# Altium project Percepção_Externa.PrjPcb
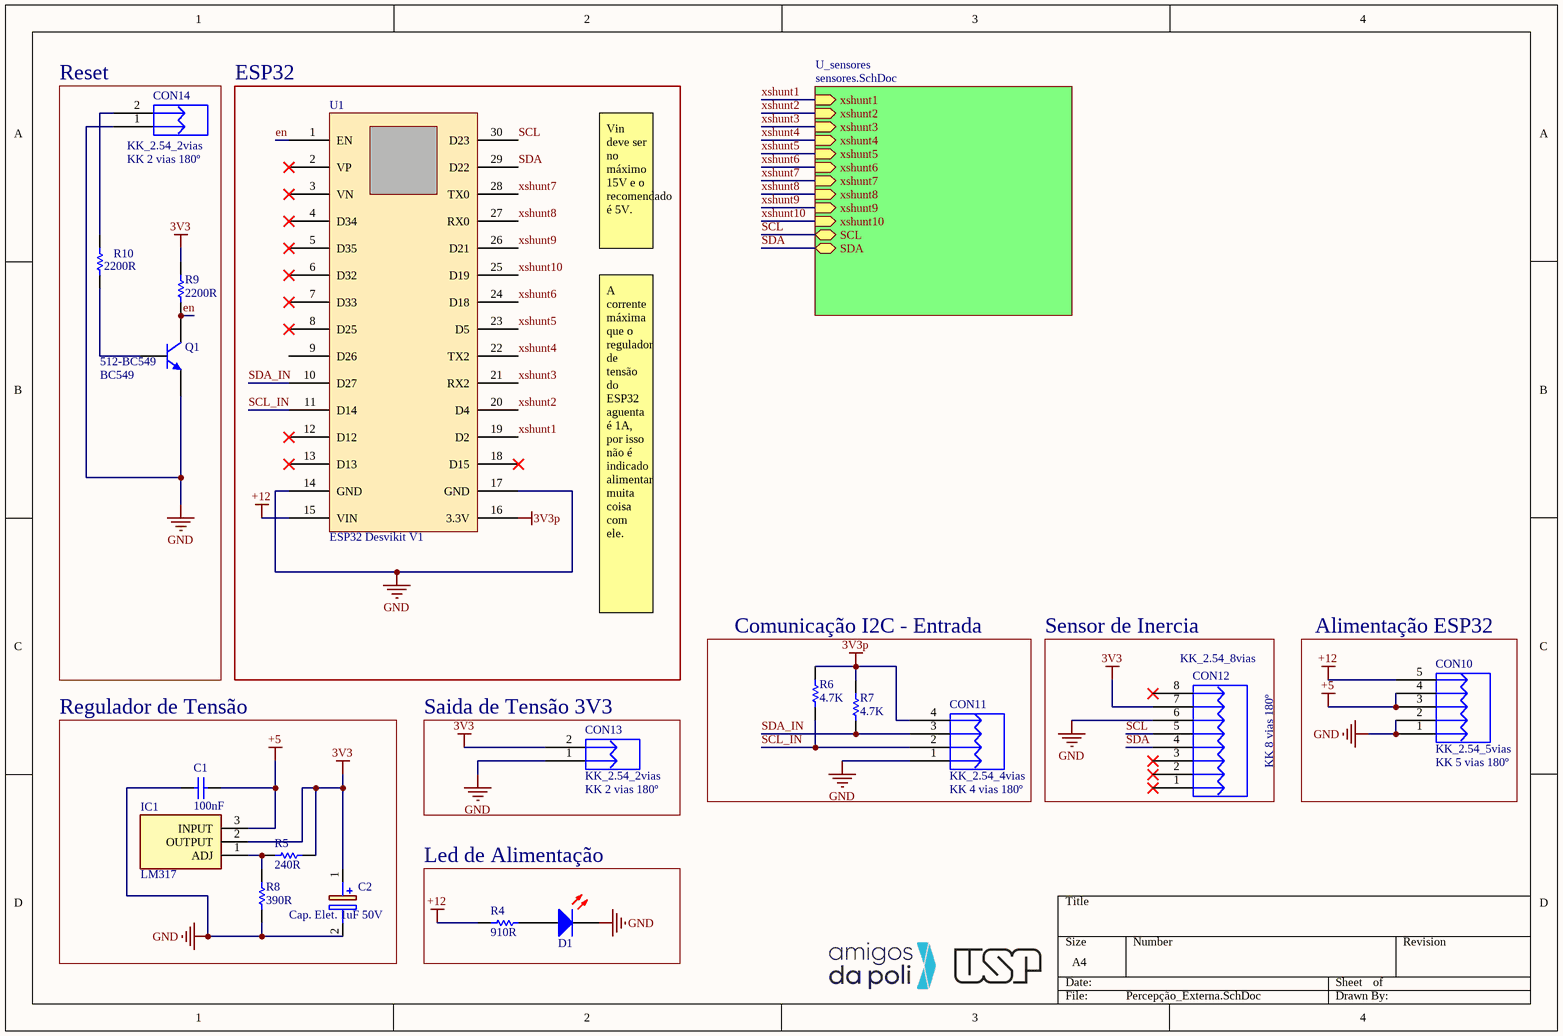
[diagram p0: Percepção_Externa.SchDoc]
1 sheet, 18 parts. Net scope: hierarchical (ports join the sheet entries above them; power ports are global).
Board file: Percepção_Externa.PcbDoc

## Sheet Percepção_Externa.SchDoc
size A4

### Parts
C1  100nF  [CAP CER DISK 100NF 50V]
C2  Cap. Elet. 1uF 50V  [Cap. Elet. 470uF 16V]
CON10  KK_2.54_5vias  Valor: KK 5 vias 180º  [KK_5vias_180°]
CON11  KK_2.54_4vias  Valor: KK 4 vias 180º  [KK_4vias_180°]
CON12  KK_2.54_8vias  Valor: KK 8 vias 180º  [KK_8vias_180°]
CON13  KK_2.54_2vias  Valor: KK 2 vias 180º  [KK_2VIAS_180º]
CON14  KK_2.54_2vias  Valor: KK 2 vias 180º  [KK_2VIAS_180º]
D1  LED 5MM RED  [LED 5MM RED]  (value not drawn)
IC1  LM317  [TO254P467X1016X1971-3P]
Q1  BC549  Supplier Part Number 1: 512-BC549  [TO92]
R4  Resistance (Ohms): 910R  [RES 470R 1/4W CARBON FILM]  (hidden comment: RES 470R 1/4W CARBON FILM)
R5  Resistance (Ohms): 240R  [RES 470R 1/4W CARBON FILM]  (hidden comment: RES 470R 1/4W CARBON FILM)
R6  4.7K  [RES 4.7K 1/4W CARBON FILM]
R7  4.7K  [RES 4.7K 1/4W CARBON FILM]
R8  Resistance (Ohms): 390R  [RES 470R 1/4W CARBON FILM]  (hidden comment: RES 470R 1/4W CARBON FILM)
R9  Resistance (Ohms): 2200R  [RES 470R 1/4W CARBON FILM]  (hidden comment: RES 470R 1/4W CARBON FILM)
R10  Resistance (Ohms): 2200R  [RES 470R 1/4W CARBON FILM]  (hidden comment: RES 470R 1/4W CARBON FILM)
U1  value ESP32 Desvikit V1  [ESP32_Desvikit_v1]  (hidden comment: microcontrolador)

### Blocks framed on the sheet
Reset: CON14 Q1 R9 R10
ESP32: U1
Comunicação I2C - Entrada: CON11 R6 R7
Sensor de Inercia: CON12
Alimentação ESP32: CON10
Regulador de Tensão: C1 C2 IC1 R5 R8
Saida de Tensão 3V3: CON13
Led de Alimentação: D1 R4

### Sub-sheets
U_sensores = sensores.SchDoc (file not in this document): xshunt1 (in), xshunt2 (in), xshunt3 (in), xshunt4 (in), xshunt5 (in), xshunt6 (in), xshunt7 (in), xshunt8 (in), xshunt9 (in), xshunt10 (in), SCL (bidir), SDA (bidir)

### Nets
3V3: C2.1(+) CON12.7 CON13.2 IC1.2(OUTPUT) R5.2 R9.2
3V3p: CON11.4 R6.1 R7.1 U1.16(3.3V)
+5: C1.2 CON10.3 CON10.4 IC1.3(INPUT)
+12: CON10.5 R4.2 U1.15(VIN)
GND: C1.1 C2.2(-) CON10.1 CON10.2 CON11.1 CON12.6 CON13.1 CON14.1 D1.2(K) Q1.3(E) R8.1 U1.14(GND) U1.17(GND)
en: Q1.1(C) R9.1 U1.1(EN)
SCL: CON12.5 U1.30(D23) ; sheet U_sensores/SCL
SCL_IN: CON11.2 R6.2 U1.11(D14)
SDA: CON12.4 U1.29(D22) ; sheet U_sensores/SDA
SDA_IN: CON11.3 R7.2 U1.10(D27)
xshunt1: U1.19(D2) ; sheet U_sensores/xshunt1
xshunt2: U1.20(D4) ; sheet U_sensores/xshunt2
xshunt3: U1.21(RX2) ; sheet U_sensores/xshunt3
xshunt4: U1.22(TX2) ; sheet U_sensores/xshunt4
xshunt5: U1.23(D5) ; sheet U_sensores/xshunt5
xshunt6: U1.24(D18) ; sheet U_sensores/xshunt6
xshunt7: U1.28(TX0) ; sheet U_sensores/xshunt7
xshunt8: U1.27(RX0) ; sheet U_sensores/xshunt8
xshunt9: U1.26(D21) ; sheet U_sensores/xshunt9
xshunt10: U1.25(D19) ; sheet U_sensores/xshunt10
NetCON14_2: CON14.2 R10.2
NetD1_1: D1.1(A) R4.1
NetIC1_1: IC1.1(ADJ) R5.1 R8.2
NetQ1_2: Q1.2(B) R10.1

Not connected (* = marked no-connect by the designer): CON12 1* 2* 3* 8*; U1 2(VP)* 3(VN)* 4(D34)* 5(D35)* 6(D32)* 7(D33)* 8(D25)* 9(D26) 12(D12)* 13(D13)* 18(D15)*

### Notes on the sheet
- Vin deve ser no máximo 15V e o recomendado é 5V.
- A corrente máxima que o regulador de tensão do  ESP32 aguenta é 1A, por isso não é indicado alimentar muita coisa com ele.

### Library data of the parts
C1 = CAP CER DISK 100NF 50V: Manufacturer Part Number: IMP14925; Product Range: MCFY Series; Capacitance: 0.1uF; Capacitance Tolerance: +80%, -20%; Dielectric Characteristic: Y5; Voltage Rating: 50; Capacitor Terminals: Radial Leaded; SVHC: No SVHC (15-Jun-2015); Supplier 1: Mult Comercial; Manufacturer: -; RoHS: YES; Stock 1: 115809; Pricing 1: 1=0.10 (BRL); Packaging: Each; Lead Spacing: 5; Operating Temperature Min: -25; Operating Temperature Max: 85; Capacitance Tolerance ±: +80%, -20%; Operating Temperature Range: -25°C to +85°C<!--FANDB--><div class="features-and-benefits-container"><div class="features-and-benefits-description"><span class="features-benefits-value">The MCFY series from Multicomp are radial leaded ceramic disc capacitors. The capacitance values ranges from 6800pF to 0.22?F.</span></div><div class="features-and-benefits-list"><ul class="features-and-benefits-list-list"><li class="features-and-benefits-list-item">Large capacitance in small size</li><li class="features-and-benefits-list-item">Rated voltage of 50V</li><li class="features-and-benefits-list-item">80%/-20% tolerance</li><li class="features-and-benefits-list-item">Operating temperature range -25°C to +85; ComponentLink1URL: http://loja.multcomercial.com.br/capacitor-ceramico-disco-100kpf-50v-104-100k-100nf-0-1uf-cod-1351.html; ComponentLink1Description: http://loja.multcomercial.com.br/capacitor-ceramico-disco-100kpf-50v-104-100k-100nf-0-1uf-cod-1351.html; Supplier Part Number 1: Capacitor Cerâmico Disco 100Kpf/50V (104/100K/100nF/0.1uF) cód. 1351
C2 = Cap. Elet. 470 uF 16V: Aluminum Organic Polymer Capacitors 16volts 470uF ESR 10mohm; Manufacturer_Name: Panasonic; Manufacturer_Part_Number: 16SEPC470M; Datasheet Link: http://industrial.panasonic.com/www-cgi/jvcr13pz.cgi?E+CI+4+AAB8010+16SEPC470M+8+WW; Height: 13mm; Mouser Part Number: 667-16SEPC470M; Mouser Price/Stock: https://www.mouser.co.uk/ProductDetail/Panasonic/16SEPC470M?qs=OE1iw1LrrPEdZuWyF2l%252B5w%3D%3D; Arrow Part Number: 16SEPC470M; Arrow Price/Stock: https://www.arrow.com/en/products/16sepc470m/panasonic
CON10 = KK_2.54_5vias: Conector KK 2.54mm 5 vias; Descrição: Conector KK 3 vias com passo 2.54mm; Encapsulamento: PTH - 180º; Modelo: 3 vias - 180º; Marca: *; Observação: *
CON11 = KK_2.54_4vias: Conector KK 2.54mm 4 vias; Descrição: Conector KK 3 vias com passo 2.54mm; Encapsulamento: PTH - 180º; Modelo: 3 vias - 180º; Marca: *; Observação: *
CON12 = KK_2.54_8vias: Conector KK 2.54mm 8 vias; Descrição: Conector KK 3 vias com passo 2.54mm; Encapsulamento: PTH - 180º; Modelo: 3 vias - 180º; Marca: *; Observação: *
CON13 CON14 = KK_2.54_2vias: Conector KK 2.54mm 2 vias; Descrição: Conector KK 3 vias com passo 2.54mm; Encapsulamento: PTH - 180º; Modelo: 2 vias - 180º; Marca: *; Observação: *
D1 = LED 5MM RED: Manufacturer: Paralight; Manufacturer Part Number: IMP585; Bulb Size: 3mm; Wavelength Typ: 625; Forward Voltage: 2; Forward Current If: 20; Luminous Intensity: 3; LED Mounting: Through Hole; Lens Shape: Round; Viewing Angle: 60°; SVHC: No SVHC (15-Jun-2015); External Diameter: 2.9; External Length / Height: 4.6; Forward Voltage VF Max: 2.5; LED / Lamp Size: 3mm / T-1; LED Type: Standard; Lead Cross-section Depth: 0.5; Luminous Intensity @ If Min: 0.7; PIV Max: 5; Peak Forward Current: 7; Voltage Vf Typ: 2.2V<!--FANDB--><div class="features-and-benefits-container"><div class="features-and-benefits-description"><span class="features-benefits-value">The L-934LID from Kingbright is a through hole round shape high efficiency red colour LED. The device is made of gallium arsenide phosphide on gallium phosphide orange light emitting diode. This LED is widely used because of low power consumption, long life and solid state reliability.</span></div><div class="features-and-benefits-list"><ul class="features-and-benefits-list-list"><li class="features-and-benefits-list-item">Standard bulb size of T-1 (3mm)</li><li class="features-and-benefits-list-item">Reliable and rugged</li><li class="features-and-benefits-list-item">Viewing angle is 60°</li><li class="features-and-benefits-list-item">Luminous intensity of 3mcd at 2mA</li><li class="features-and-benefits-list-item">Forward voltage is 2.0V</li><li class="features-and-benefits-list-item">Forward current (If) is 20mA</li><li class="features-and-benefits-list-item">Dominant wavelength is 625nm at IF=20mA</li><li class="features-and-benefits-list-item">Peak wavelength is 627nm at IF=20; Supplier 1: Mult Comercial; RoHS: YES; Stock 1: 35260; Pricing 1: 1=0.15 (BRL); LED Colour: Red; Packaging: Each; MSL: -; Current If Luminous Intensity: 2; Dominant Wavelength: 625; Forward Current If Max: 20; Lead Cross-section Width: 0.5; Lead Spacing: 2.54; Luminous Intensity Typ: 3; Mounting Type: PCB Through Hole; No. of Pins: 2; Operating Temperature Max: 85; Operating Temperature Min: -40; Operating Temperature Range: -40°C to +85; Peak Wavelength: 625; ComponentLink1URL: http://loja.multcomercial.com.br/led-3mm-vermelho-difuso-l-314hd-paralight.html; ComponentLink1Description: http://loja.multcomercial.com.br/led-3mm-vermelho-difuso-l-314hd-paralight.html; Supplier Part Number 1: Led 3mm Vermelho Difuso L-314HD - Paralight
IC1 = LM317: Integrated Circuit; Manufacturer_Name: Changjiang Electronics Tech (CJ); Datasheet Link: https://datasheet.lcsc.com/szlcsc/Changjiang-Electronics-Tech-CJ-LM317_C22147.pdf; Height: 4.67mm; Manufacturer_Part_Number: LM317
Q1 = BC549: TRANS NPN 30V 0.1A TO-92; Manufacturer: Fairchild Semiconductor; Configuration: Single; Emitter- Base Voltage VEBO: 5 V; Collector-Emitter Saturation Voltage: 200 mV; Gain Bandwidth Product fT: 300 MHz; DC Collector/Base Gain hfe Min: 110; DC Current Gain hFE Max: 800; Maximum Power Dissipation: 0.5 W; Supplier 1: Mouser; Manufacturer Part Number: BC549; Product Category: Bipolar Transistors - BJT; RoHS: Details; Transistor Polarity: NPN; Collector- Base Voltage VCBO: 30 V; Collector- Emitter Voltage VCEO Max: 30 V; Maximum DC Collector Current: 0.1 A; Maximum Operating Temperature: + 150 C; Mounting Style: Through Hole; Package / Case: TO-92-3; Brand: Fairchild Semiconductor; Minimum Operating Temperature: - 65 C; Packaging: Bulk; Series: BC549; Factory Pack Quantity: 2000; ComponentLink1URL: https://datasheet.ciiva.com/982/bc546-982130.pdf; ComponentLink1Description: https://datasheet.ciiva.com/982/bc546-982130.pdf; ComponentLink2URL: https://datasheet.ciiva.com/17179/bc549-17179663.pdf; ComponentLink2Description: https://datasheet.ciiva.com/17179/bc549-17179663.pdf
R4 R5 R8-R10 = RES 470R 1/4W CARBON FILM: RES 470R OHM 1/4W 5% CARBON FILM; Manufacturer: Ty-Ohm; Manufacturer Part Number: CR25; Power (Watts): 0.25W, 1/4W; Temperature Coefficient: 0/ -500ppm/°C; Supplier 1: Mult Comercial; RoHS: RoHS Compliant; Category: Resistors; Stock 1: 617543; Pricing 1: 1=0.20 (BRL); Packaging: Cut Tape (CT); Tolerance: ±5%; Composition: Carbon Film; Features: Flame Retardant Coating, Safety; Operating Temperature: -55°C ~ 155°C; Package / Case: Axial; Supplier Device Package: Axial; Size / Dimension: 0.091" Dia x 0.256" L (2.30mm x 6.50mm); Height: -; Number of Terminations: 2; ComponentLink1URL: http://loja.multcomercial.com.br/resistor-de-1-4-de-watt-cr25-5-de-tolerancia.html; ComponentLink1Description: http://loja.multcomercial.com.br/resistor-de-1-4-de-watt-cr25-5-de-tolerancia.html; Supplier Part Number 1: Resistor de Filme de Carbono 1/4 de Watt CR25 5% de tolerância - 0.22R Ω à 10M Ω
R6 R7 = RES 4.7K 1/4W CARBON FILM: RES 4.7K OHM 1/4W 5% CARBON FILM; Manufacturer: Ty-Ohm; Manufacturer Part Number: CR25; Power (Watts): 0.25W, 1/4W; Temperature Coefficient: 0/ -500ppm/°C; Supplier 1: Mult Comercial; RoHS: RoHS Compliant; Category: Resistors; Stock 1: 617543; Pricing 1: 1=0.20 (BRL); Packaging: Cut Tape (CT); Tolerance: ±5%; Composition: Carbon Film; Features: Flame Retardant Coating, Safety; Operating Temperature: -55°C ~ 155°C; Package / Case: Axial; Supplier Device Package: Axial; Size / Dimension: 0.091" Dia x 0.256" L (2.30mm x 6.50mm); Height: -; Number of Terminations: 2; ComponentLink1URL: http://loja.multcomercial.com.br/resistor-de-1-4-de-watt-cr25-5-de-tolerancia.html; ComponentLink1Description: http://loja.multcomercial.com.br/resistor-de-1-4-de-watt-cr25-5-de-tolerancia.html; Supplier Part Number 1: Resistor de Filme de Carbono 1/4 de Watt CR25 5% de tolerância - 0.22R Ω à 10M Ω; Resistance (Ohms): ?
U1 = ESP32 Desvikit v1: microcontrolador com moculo bluethoth e wifi